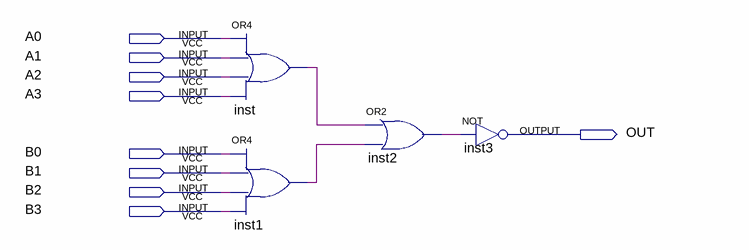
[diagram p0: schematic sheet]
// Quartus schematic eh_zero.bdf as structural Verilog: 4 symbols, 9 pins
module eh_zero (
  input  A0,
  input  A1,
  input  A2,
  input  A3,
  input  B0,
  input  B1,
  input  B2,
  input  B3,
  output OUT
);

  wire inst1_out, inst2_out, inst_out;

  or inst (inst_out, A0, A1, A2, A3);
  or inst1 (inst1_out, B0, B1, B2, B3);
  or inst2 (inst2_out, inst_out, inst1_out);
  not inst3 (OUT, inst2_out);
endmodule
